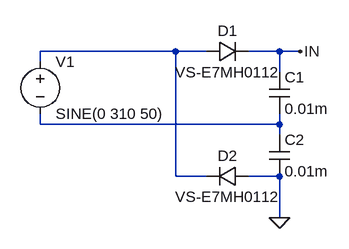
[diagram p0: schematic double_voltage.asc]
double_voltage.asc, the LTspice schematic file:
Version 4
SHEET 1 880 680
WIRE 0 -640 -208 -640
WIRE 48 -640 0 -640
WIRE 160 -640 112 -640
WIRE 192 -640 160 -640
WIRE -208 -624 -208 -640
WIRE 160 -608 160 -640
WIRE -208 -528 -208 -544
WIRE 160 -528 160 -544
WIRE 160 -528 -208 -528
WIRE 160 -512 160 -528
WIRE 0 -448 0 -640
WIRE 48 -448 0 -448
WIRE 160 -448 112 -448
WIRE 160 -384 160 -448
FLAG 160 -384 0
FLAG 192 -640 IN
SYMBOL diode 48 -624 R270
WINDOW 0 32 32 VTop 2
WINDOW 3 0 32 VBottom 2
SYMATTR InstName D1
SYMATTR Value VS-E7MH0112
SYMBOL voltage -208 -640 R0
WINDOW 123 0 0 Left 0
WINDOW 39 0 0 Left 0
SYMATTR InstName V1
SYMATTR Value SINE(0 310 50)
SYMBOL cap 144 -608 R0
SYMATTR InstName C1
SYMATTR Value 0.01m
SYMBOL diode 112 -464 R90
WINDOW 0 0 32 VBottom 2
WINDOW 3 32 32 VTop 2
SYMATTR InstName D2
SYMATTR Value VS-E7MH0112
SYMBOL cap 144 -512 R0
SYMATTR InstName C2
SYMATTR Value 0.01m

The netlist it stands for:
* double_voltage.asc
D1 N001 IN VS-E7MH0112
V1 N001 N002 SINE(0 310 50)
C1 IN N002 0.01m
D2 0 N001 VS-E7MH0112
C2 N002 0 0.01m
.model D D
.lib standard.dio
.backanno
.end